# EAGLE design thermocouple (EAGLE 8.0.1)
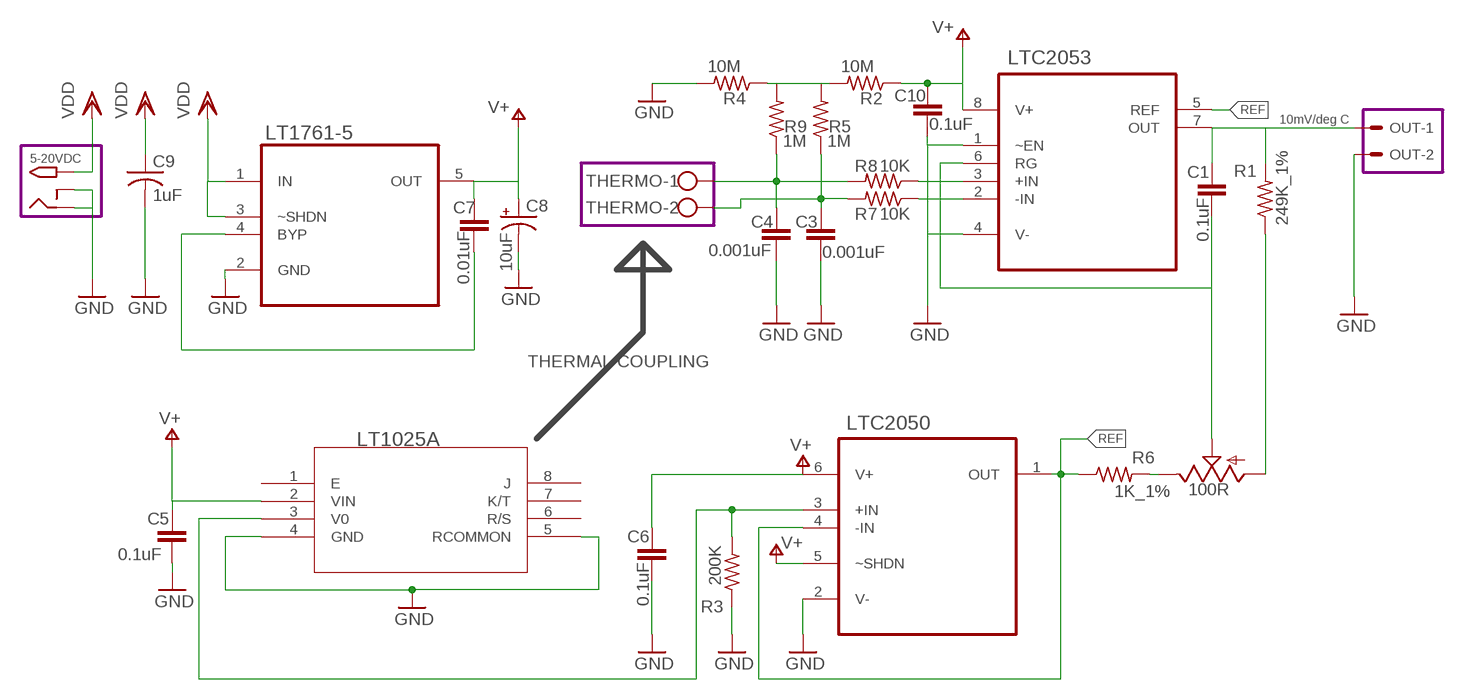
[diagram p0: schematic, sheet 1]

## Parts
5-20VDC  DC_IN  2.1MMJACKTHM  [PJ-102A]
C1  0.1uF  C-EUC0805  [C0805]
C3  0.001uF  C-EUC0805  [C0805]
C4  0.001uF  C-EUC0805  [C0805]
C5  0.1uF  C-EUC0805  [C0805]
C6  0.1uF  C-EUC0805  [C0805]
C7  0.01uF  C-EUC0805  [C0805]
C8  10uF  CPOL-USE2,5-6E  [E2,5-6E]
C9  1uF  C-USC0805  [C0805]
C10  0.1uF  C-EUC0805  [C0805]
OUT  10mV/C  22-27-2021-02  [6410-02]
POT  100R  TRIM  [6MM]
R1  249K_1%  R-US_R0805  [R0805]
R2  10M  R-US_R0805  [R0805]
R3  200K  R-US_M0805  [M0805]
R4  10M  R-US_R0805  [R0805]
R5  1M  R-US_R0805  [R0805]
R6  1K_1%  R-US_R0805  [R0805]
R7  10K  R-US_R0805  [R0805]
R8  10K  R-US_R0805  [R0805]
R9  1M  R-US_R0805  [R0805]
THERMO  W237-102  [W237-102]
U1  LT1025A  LT1025ACN8  [PDIP-8_N]
U2  LTC2053  LTC2053CMS8PBF  [SOP65P490X110-8N]
U3  LTC2050  LTC2050HVIS6PBF  [SOT95P280X100-6N]
U4  LT1761-5  LT1761ES5-5PBF  [SOT95P280X100-5N]

## Nets
GND: 5-20VDC.RING 5-20VDC.RING_SW C3.1 C4.2 C5.2 C6.2 C8.- C9.2 C10.1 OUT.2 R3.1 R4.2 U1.4(GND) U1.5(RCOMMON) U2.1(~EN) U2.4(V-) U3.2(V-) U4.2(GND)
N$1: C1.2 POT.S U2.6(RG)
N$2: C1.1 OUT.1 R1.2 U2.7(OUT)
N$3: POT.A R1.1
N$4: R2.2 R4.1 R5.2 R9.2
N$5: R7.1 U2.2(-IN)
N$6: R8.1 U2.3(+IN)
N$7: C3.2 R5.1 R7.2 THERMO.2
N$8: C4.1 R8.2 R9.1 THERMO.1
N$11: R3.2 U1.3(V0) U3.3(+IN)
N$14: C7.2 U4.4(BYP)
N$16: POT.E R6.2
REF: R6.1 U2.5(REF) U3.1(OUT) U3.4(-IN)
V+: C5.1 C6.1 C7.1 C8.+ C10.2 R2.1 U1.2(VIN) U2.8(V+) U3.5(~SHDN) U3.6(V+) U4.5(OUT)
VDD: 5-20VDC.TIP C9.1 U4.1(IN) U4.3(~SHDN)
Unconnected: U1.1(E) U1.6(R/S) U1.7(K/T) U1.8(J)

## Notes on the sheet
- 10mV/deg C
- THERMAL COUPLING

## Library data of the parts
5-20VDC = adafruit:2.1MMJACK: 2.1mm x 5.5mm THM DC jack with internal switch. Digikey part #PJ-102A, 4UCON part #05537 2.1mm x 5.5mm SMT DC jack with internal switch. Digikey part #PJ-002A-SMT, 4UCON part #03267 By microbuilder.eu & adafruit.com
C1 C3-C7 C10 = rcl_:C-EU: CAPACITOR, European symbol
C8 = adafruit:CPOL-US: POLARIZED CAPACITOR, American symbol
C9 = adafruit:C-US: CAPACITOR, American symbol
OUT = con-molex:22-?-02: CONNECTOR wire to board 2.54 mm (.1 inch) pitch header; OC_FARNELL: unknown; OC_NEWARK: unknown
POT = adafruit:TRIM
R1-R9 = rcl_:R-US_: RESISTOR, American symbol
THERMO = con-wago-500:W237-102: WAGO SCREW CLAMP; MPN: 237-102; OC_FARNELL: unknown; OC_NEWARK: 70K9898
U1 = LT1025ACN8:LT1025ACN8; AVAILABILITY: Unavailable; DESCRIPTION: LT1025 - Micropower Thermocouple Cold Junction Compensator; MF: Linear Technology; MP: LT1025ACN8; PACKAGE: PDIP-8 Linear Technology; PRICE: 3.89 USD
U2 = LTC:LTC2053CMS8PBF: Precision, Rail-to-Rail,Zero-Drift, Resistor-Programmable Instrumentation Amplifier; MPN: LTC2053CMS8#PBF; OC_FARNELL: -; OC_NEWARK: 56M4714; PACKAGE: MSOP-8; SUPPLIER: Linear Technology
U3 = LTC:LTC2050HVIS6PBF: Zero-Drift OPAMPs; MPN: LTC2050HVIS6#PBF; OC_FARNELL: -; OC_NEWARK: 11R6655; PACKAGE: TSOT-6; SUPPLIER: Linear Technology
U4 = LTC:LT1761ES5-5PBF: 100mA, Low Noise,LDO Micropower Regulators; MPN: LT1761ES5-5#PBF; OC_FARNELL: 1533302; OC_NEWARK: 61M3359; PACKAGE: TSOT-23-5; SUPPLIER: Linear Technology

## Net classes
0 default: clearance 0.254 mm

## Board
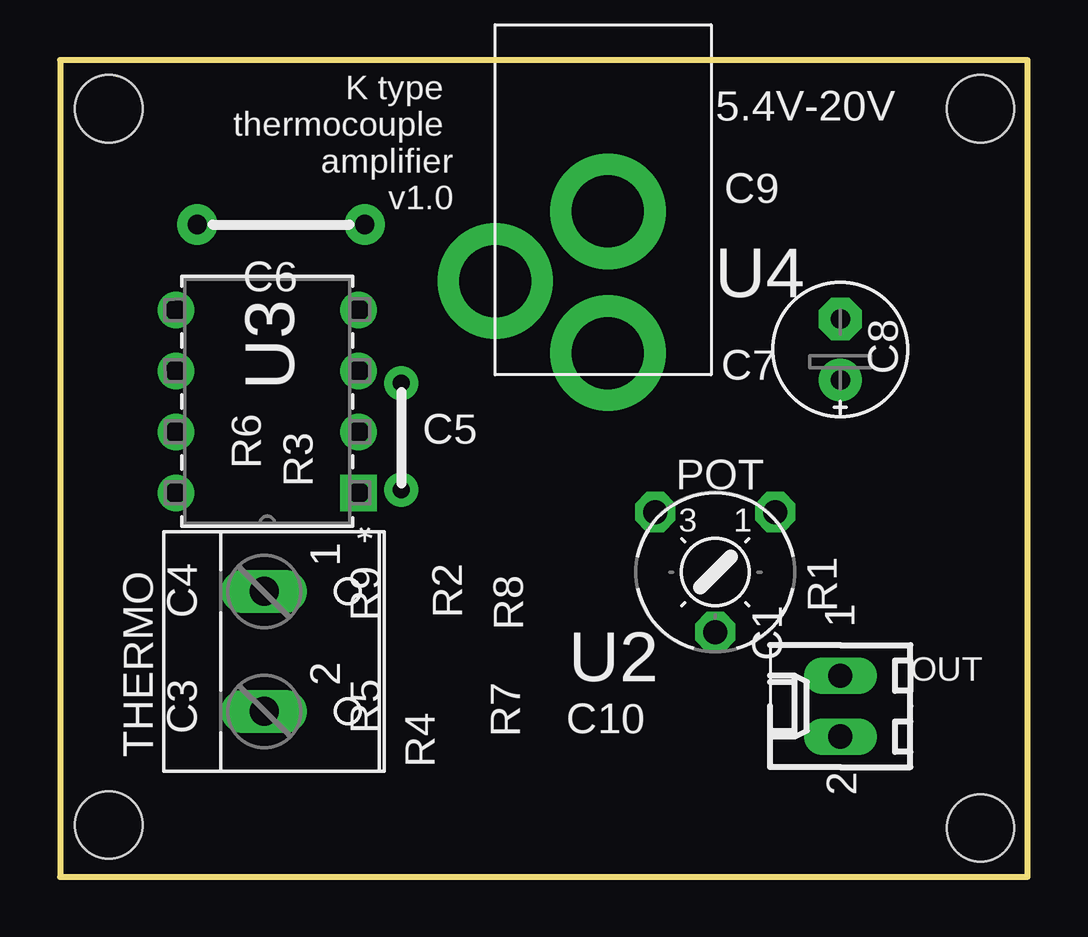
[diagram p1: board, top side]
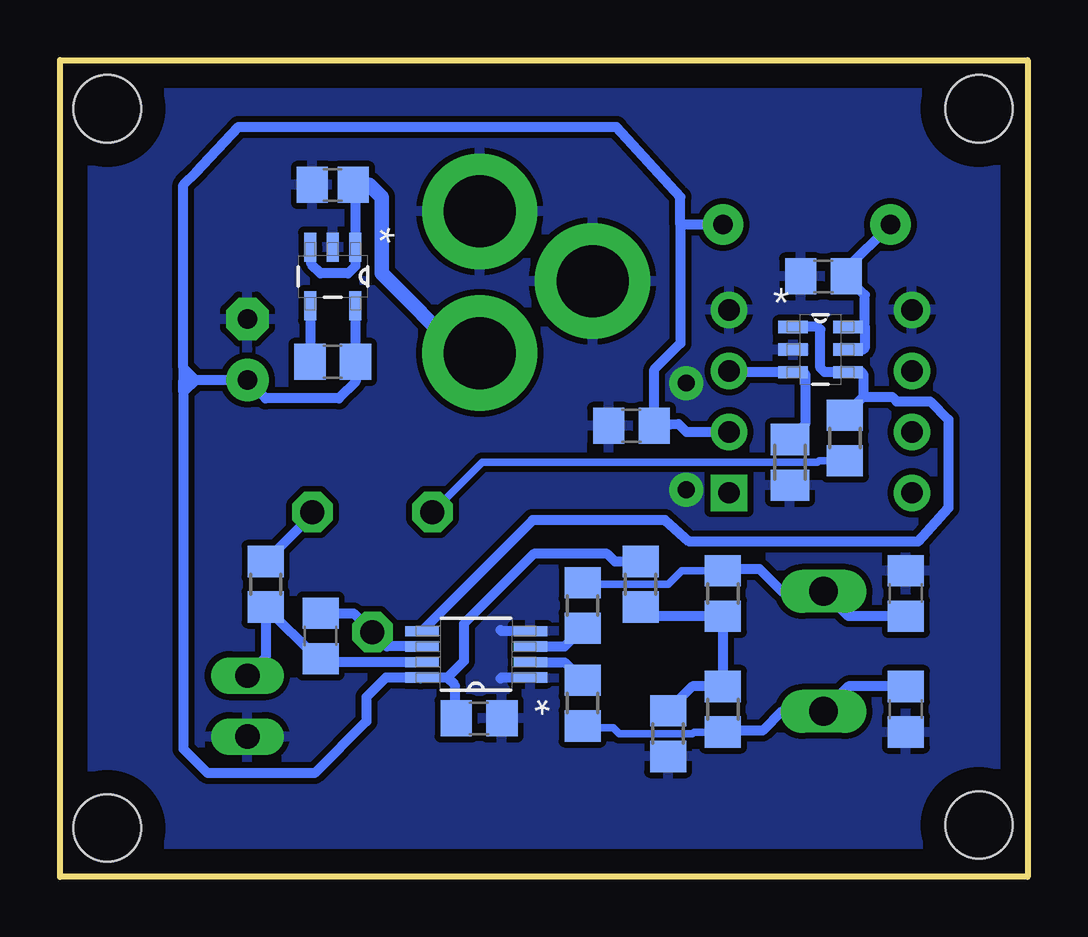
[diagram p2: board, bottom side, seen from below]

Size 40.32 x 34.04 mm. Coordinates in mm from the lower left corner, seen from the top.
Outline: 0,0 40.31,0 40.31,34.03 0,34.03 0,0
Outline: 0,0 0,34.04 40.32,34.04 40.32,0 0,0
Copper layers (1*16): Top 0.035mm / dielectric 1.5mm / Bottom 0.035mm
Design rules "default": minimum track width 10mil, minimum drill 24mil, track to track 8mil, track to pad 8mil, pad to pad 8mil, via to via 8mil, smd to smd 8mil, copper to edge 40mil, drill to drill 8mil, minimum pad ring 10mil, minimum via ring 8mil, stop-mask expansion 4mil, vias tented up to drill 0mil, thermal gap 10mil
Holes 2.8 mm at 2.03,2.16 38.35,2.03 38.35,32 2.03,32

### Footprints (pad centres in the part's own frame; a part is rotated, then mirrored left to right if it is on the bottom)
PJ-102A = drill 3 pad 4.8: RING 0.1,-3.39; RING_SW -4.6,-6.29; TIP 0.1,-9.29
C0805 = smd 1.3 x 1.5: 1 -0.95,0; 2 0.95,0
E2,5-6E = drill 0.813 pad 1.778: + -1.27,0 | drill 0.813 pad 1.778 octagon: - 1.27,0
C0805' = smd 1.3 x 1.5: 1 -0.85,0; 2 0.85,0
6410-02 = drill 1.016 long: 1 1.27,0; 2 -1.27,0
6MM = drill 1 pad 1.676 octagon: A -2.5,-2.5; E 2.5,-2.5; S 0,2.5
R0805 = smd 1.3 x 1.5: 1 -0.95,0; 2 0.95,0
M0805 = smd 1.3 x 1.6: 1 -0.95,0; 2 0.95,0
W237-102 = drill 1.194 long: 1 -2.5,-1.27; 2 2.5,-1.27
PDIP-8_N = drill 0.889 pad 1.524 square: 1 -7.62,7.62 | drill 0.889 pad 1.524: 2 -7.62,5.08; 3 -7.62,2.54; 4 -7.62,0; 5 0,0; 6 0,2.54; 7 0,5.08; 8 0,7.62
SOP65P490X110-8N = smd 1.397 x 0.432: 1 -2.261,0.965; 2 -2.261,0.33; 3 -2.261,-0.33; 4 -2.261,-0.965; 5 2.261,-0.965; 6 2.261,-0.33; 7 2.261,0.33; 8 2.261,0.965
SOT95P280X100-6N = smd 1.219 x 0.508: 1 -1.143,0.94; 2 -1.143,0; 3 -1.143,-0.94; 4 1.143,-0.94; 5 1.143,0; 6 1.143,0.94
SOT95P280X100-5N = smd 1.219 x 0.508: 1 -1.219,0.94; 2 -1.219,0; 3 -1.219,-0.94; 4 1.219,-0.94; 5 1.219,0.94

### Placement (x,y rotation side)
5-20VDC  22.73,31.12 0 top
C1  29.46,10.03 90 bottom
C3  5.08,6.98 90 bottom
C4  5.08,11.81 90 bottom
C5  16.51,18.8 180 bottom
C6  8.51,25.02 180 bottom
C7  28.96,21.46 180 bottom
C8  32.51,21.97 90 top
C9  1uF  [C0805']  28.96,28.83 180 bottom
C10  22.86,6.6 180 bottom
OUT  32.51,7.11 90 top
POT  27.31,12.7 180 top
R1  31.75,12.19 270 bottom
R2  16.13,12.19 270 bottom
R3  9.91,17.27 90 bottom
R4  14.99,5.97 270 bottom
R5  12.7,6.98 90 bottom
R6  7.62,18.29 270 bottom
R7  18.54,7.24 270 bottom
R8  18.54,11.3 90 bottom
R9  12.7,11.81 270 bottom
THERMO  9.78,9.4 270 top
U1  4.83,23.62 180 top
U2  22.99,9.27 180 bottom
U3  8.64,21.97 0 bottom
U4  28.96,25.02 270 bottom

### Tracks (layer width: path | path; a pad name or v marks a point on that pad's centre or on a via)
GND  (via drill 0.7 pad 1.42)
  Top 0.305: v14.22,20.57 v14.22,16.13
  Bottom 0.406: U2.1 21.92,8.31 21.97,8.25 | U2.4 21.92,10.24 21.97,10.29
  pour Bottom: -0.38,34.42 40.77,34.42 40.89,-0.76 -0.25,-0.63
N$1
  Bottom 0.406: U2.6 26.71,9.6 POT.S 28.09,10.98 C1.2
N$2
  Bottom 0.406: U2.7 29.32,8.94 C1.1 29.59,9.08 R1.2 31.75,9.14 OUT.1
N$3
  Bottom 0.406: POT.A 29.81,15.09 R1.1
N$4
  Bottom 0.406: R2.2 15.75,10.86 R9.2 R5.2 13.97,7.93 R4.1
N$5
  Bottom 0.406: U2.2 19.29,8.94 R7.1
N$6
  Bottom 0.406: U2.3 19.29,9.6 R8.1
N$7
  Bottom 0.305: R5.1 13.9,6.04 13.97,5.97 17.02,5.97 17.27,6.22 18.48,6.22 R7.2
  Bottom 0.406: C3.2 7.47,7.93 THERMO.2 10.25,6.9 11.05,6.1 12.26,6.1 R5.1
N$8
  Bottom 0.305: R9.1 14.42,12.76 14.99,12.19 18.48,12.19 R8.2
  Bottom 0.406: C4.1 7.47,10.86 THERMO.1 10.25,11.9 11.18,12.83 12.25,12.83 R9.1
N$11
  Bottom 0.406: 9.83,21.08 U3.3 | U3.3 9.35,21.03 9.27,20.95 9.27,18.86 R3.2 | U3.3 12.39,21.03 U1.3
N$14
  Bottom 0.406: U4.4 29.9,21.47 C7.2
N$16
  Bottom 0.305: R6.2 8.7,17.34 8.76,17.27 22.73,17.27 POT.E
REF
  Bottom 0.406: 6.86,20 6.86,20.95 6.93,21.03 U3.4 8.46,21.03 8.64,21.21 8.64,22.8 8.76,22.92 9.73,22.92 U3.1 | 6.86,20 R6.1 | 6.86,20 5.65,20 5.46,19.81 4.06,19.81 3.3,19.05 3.3,15.37 4.57,13.97 14.1,13.97 15.11,14.86 20.63,14.86 U2.5
V+  (via drill 0.8 pad 1.68)
  Top 0.305: v5.71,27.18 v12.7,27.18
  Bottom 0.406: U4.5 C7.1 28.01,20.63 28.7,19.94 31.75,19.94 C8.+ | 24.18,8.31 U2.8 | 24.18,8.31 23.88,8 23.88,6.67 C10.2 | 24.18,8.31 23.5,8.99 23.5,10.54 20.57,13.46 17.53,13.46 17.21,13.14 R2.1 | 6.78,22.91 U3.6 | 6.78,22.91 6.79,22.8 6.79,22.03 6.86,21.97 U3.5 | 6.78,22.91 6.78,24.24 C6.1 7.56,25.33 v5.71,27.18 | U1.2 14.22,18.54 14.54,18.86 C5.1 15.56,21.14 14.48,22.23 14.48,27.18 | C8.+ 33.27,20.7 | 25.3,8.25 U2.8 | U2.8 26.75,8.31 27.56,7.49 27.56,6.48 29.72,4.32 34.16,4.32 35.18,5.33 35.18,20.19 | 14.48,27.18 14.48,28.32 17.14,31.24 32.89,31.24 34.67,29.34 35.18,28.83 35.18,21.21 | v12.7,27.18 14.48,27.18 | 35.18,21.21 35.18,20.7 | 35.18,20.19 35.18,20.7 | C8.+ 34.67,20.7 | 34.67,20.7 35.18,20.7 | 34.67,20.7 35.18,20.19 | 34.67,20.7 35.18,21.21
VDD
  Bottom 0.406: C9.1 28.02,28.74 U4.1 28.02,25.45 28.32,25.15 29.46,25.15 29.85,25.53 29.85,26.19 U4.3
  Bottom 0.61: 5-20VDC.TIP 23.6,21.83 26.92,25.15 26.92,28.32 27.43,28.83 C9.1

### Text on the board
tNames: K type / thermocouple / amplifier / v1.0 | 5.4V-20V